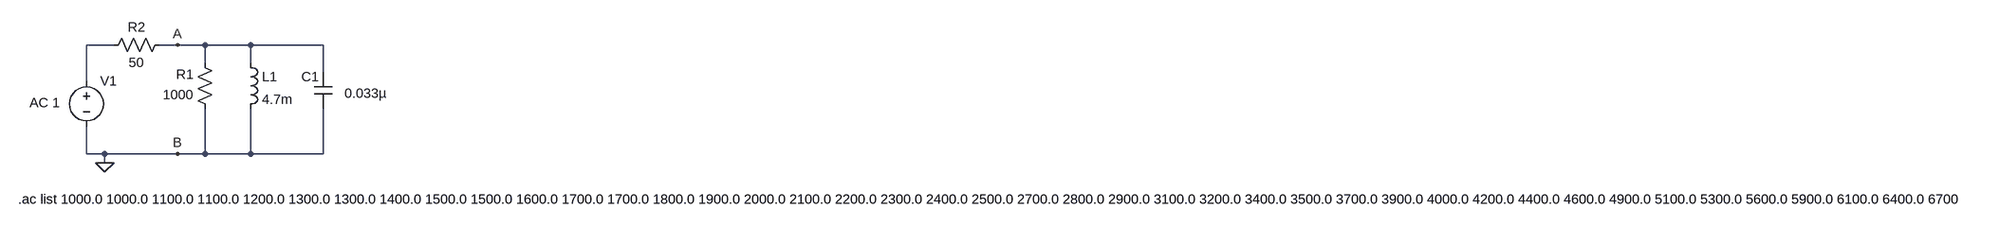
[diagram p0: schematic parallel.asc]
parallel.asc, the LTspice schematic file:
Version 4
SHEET 1 9424 680
WIRE 48 64 0 64
WIRE 160 64 128 64
WIRE 208 64 160 64
WIRE 288 64 208 64
WIRE 416 64 288 64
WIRE 208 96 208 64
WIRE 288 96 288 64
WIRE 416 112 416 64
WIRE 0 128 0 64
WIRE 0 256 0 208
WIRE 32 256 0 256
WIRE 160 256 32 256
WIRE 208 256 208 176
WIRE 208 256 160 256
WIRE 288 256 288 176
WIRE 288 256 208 256
WIRE 416 256 416 176
WIRE 416 256 288 256
WIRE 32 272 32 256
FLAG 160 64 A
FLAG 160 256 B
FLAG 32 272 0
SYMBOL voltage 0 112 R0
WINDOW 3 -100 54 Left 2
WINDOW 123 0 0 Left 0
WINDOW 39 0 0 Left 0
SYMATTR InstName V1
SYMATTR Value AC 1
SYMBOL res 224 192 R180
WINDOW 0 36 76 Left 2
WINDOW 3 36 40 Left 2
SYMATTR InstName R1
SYMATTR Value 1000
SYMBOL ind 272 80 R0
SYMATTR InstName L1
SYMATTR Value 4.7m
SYMBOL cap 432 176 R180
WINDOW 0 24 56 Left 2
WINDOW 3 -96 27 Left 2
SYMATTR InstName C1
SYMATTR Value 0.033µ
SYMBOL res 144 48 R90
WINDOW 0 0 56 VBottom 2
WINDOW 3 32 56 VTop 2
SYMATTR InstName R2
SYMATTR Value 50
TEXT -120 336 Left 2 !.ac list 1000.0 1000.0 1100.0 1100.0 1200.0 1300.0 1300.0 1400.0 1500.0 1500.0 1600.0 1700.0 1700.0 1800.0 1900.0 2000.0 2100.0 2200.0 2300.0 2400.0 2500.0 2700.0 2800.0 2900.0 3100.0 3200.0 3400.0 3500.0 3700.0 3900.0 4000.0 4200.0 4400.0 4600.0 4900.0 5100.0 5300.0 5600.0 5900.0 6100.0 6400.0 6700.0 7100.0 7400.0 7700.0 8100.0 8500.0 8900.0 9300.0 9800.0 10200.0 10700.0 11200.0 11800.0 12300.0 12900.0 13500.0 14200.0 14800.0 15600.0 16300.0 17100.0 17900.0 18700.0 19600.0 20600.0 21500.0 22600.0 23600.0 24800.0 26000.0 27200.0 28500.0 29800.0 31300.0 32700.0 34300.0 35900.0 37600.0 39400.0 41300.0 43300.0 45300.0 47500.0 49800.0 52100.0 54600.0 57200.0 59900.0 62800.0 65800.0 68900.0 72200.0 75600.0 79200.0 83000.0 87000.0 91100.0 95500.0 100000.0

The netlist it stands for:
* parallel.asc
V1 N001 0 AC 1
R1 0 A 1000
L1 A 0 4.7m
C1 0 A 0.033µ
R2 A N001 50
.ac list 1000.0 1000.0 1100.0 1100.0 1200.0 1300.0 1300.0 1400.0 1500.0 1500.0 1600.0 1700.0 1700.0 1800.0 1900.0 2000.0 2100.0 2200.0 2300.0 2400.0 2500.0 2700.0 2800.0 2900.0 3100.0 3200.0 3400.0 3500.0 3700.0 3900.0 4000.0 4200.0 4400.0 4600.0 4900.0 5100.0 5300.0 5600.0 5900.0 6100.0 6400.0 6700.0 7100.0 7400.0 7700.0 8100.0 8500.0 8900.0 9300.0 9800.0 10200.0 10700.0 11200.0 11800.0 12300.0 12900.0 13500.0 14200.0 14800.0 15600.0 16300.0 17100.0 17900.0 18700.0 19600.0 20600.0 21500.0 22600.0 23600.0 24800.0 26000.0 27200.0 28500.0 29800.0 31300.0 32700.0 34300.0 35900.0 37600.0 39400.0 41300.0 43300.0 45300.0 47500.0 49800.0 52100.0 54600.0 57200.0 59900.0 62800.0 65800.0 68900.0 72200.0 75600.0 79200.0 83000.0 87000.0 91100.0 95500.0 100000.0
.backanno
.end

* Results of the author's LTspice run, read from the files saved beside the schematic
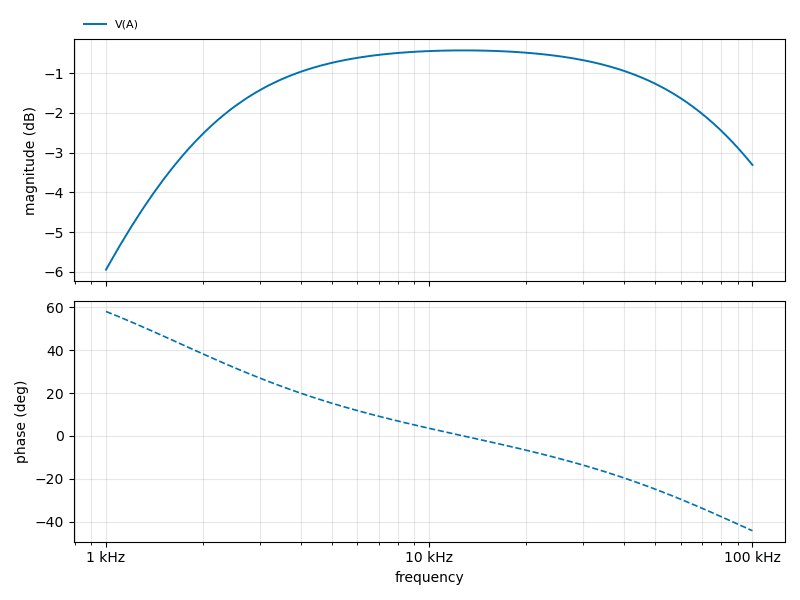
[diagram p1: AC Analysis of parallel.asc, plotted from the saved traces]
* AC Analysis, 1 run:
*   V(A): -5.95 dB at 1 kHz, -3.31 dB at 100 kHz, peak -0.42 dB at 12.9 kHz, 3 dB below the peak at 1.588 kHz